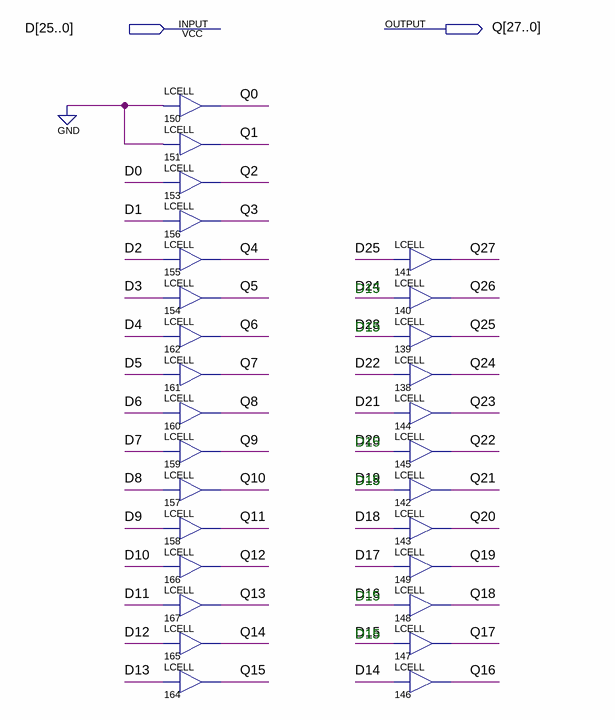
[diagram p0: schematic sheet]
// Quartus schematic SignExt26to31.bdf as structural Verilog: 28 symbols, 2 pins
module SignExt26to31 (
  input  [25:0] D,
  output [27:0] Q
);

  LCELL u_150 (.IN(1'b0), .OUT(Q[0]));
  LCELL u_151 (.IN(1'b0), .OUT(Q[1]));
  LCELL u_153 (.IN(D[0]), .OUT(Q[2]));
  LCELL u_156 (.IN(D[1]), .OUT(Q[3]));
  LCELL u_155 (.IN(D[2]), .OUT(Q[4]));
  LCELL u_154 (.IN(D[3]), .OUT(Q[5]));
  LCELL u_162 (.IN(D[4]), .OUT(Q[6]));
  LCELL u_161 (.IN(D[5]), .OUT(Q[7]));
  LCELL u_160 (.IN(D[6]), .OUT(Q[8]));
  LCELL u_159 (.IN(D[7]), .OUT(Q[9]));
  LCELL u_157 (.IN(D[8]), .OUT(Q[10]));
  LCELL u_158 (.IN(D[9]), .OUT(Q[11]));
  LCELL u_166 (.IN(D[10]), .OUT(Q[12]));
  LCELL u_167 (.IN(D[11]), .OUT(Q[13]));
  LCELL u_165 (.IN(D[12]), .OUT(Q[14]));
  LCELL u_164 (.IN(D[13]), .OUT(Q[15]));
  LCELL u_141 (.IN(D[25]), .OUT(Q[27]));
  LCELL u_140 (.IN(D[24]), .OUT(Q[26]));
  LCELL u_139 (.IN(D[23]), .OUT(Q[25]));
  LCELL u_138 (.IN(D[22]), .OUT(Q[24]));
  LCELL u_144 (.IN(D[21]), .OUT(Q[23]));
  LCELL u_145 (.IN(D[20]), .OUT(Q[22]));
  LCELL u_142 (.IN(D[19]), .OUT(Q[21]));
  LCELL u_143 (.IN(D[18]), .OUT(Q[20]));
  LCELL u_149 (.IN(D[17]), .OUT(Q[19]));
  LCELL u_148 (.IN(D[16]), .OUT(Q[18]));
  LCELL u_147 (.IN(D[15]), .OUT(Q[17]));
  LCELL u_146 (.IN(D[14]), .OUT(Q[16]));

  // Notes on the sheet:
  //   D15
  //   D15
  //   D15
  //   D15
  //   D15
  //   D15
  //   D15
  //   D15
  //   D15
endmodule
